# Altium schematic sheet 2_MCU.SchDoc
size A3; DocumentNumber: 3; SheetNumber: 3; SheetTotal: 6; PageSetup: Record=PageOptions|CenterHorizontal=True|CenterVertical=True|PrintScale=1.01|XCorrection=1.00|YCorrection=1.00|PrintKind=0|BorderSize=5000000|LeftOffset=0|BottomOffset=0|Orientation=2|PaperLength=1000|PaperWidth=1000|Scale=100|PaperSource=7|PrintQuality=-4|MediaType=1|DitherType=10|PaperKind=A3|PrintScaleMode=1
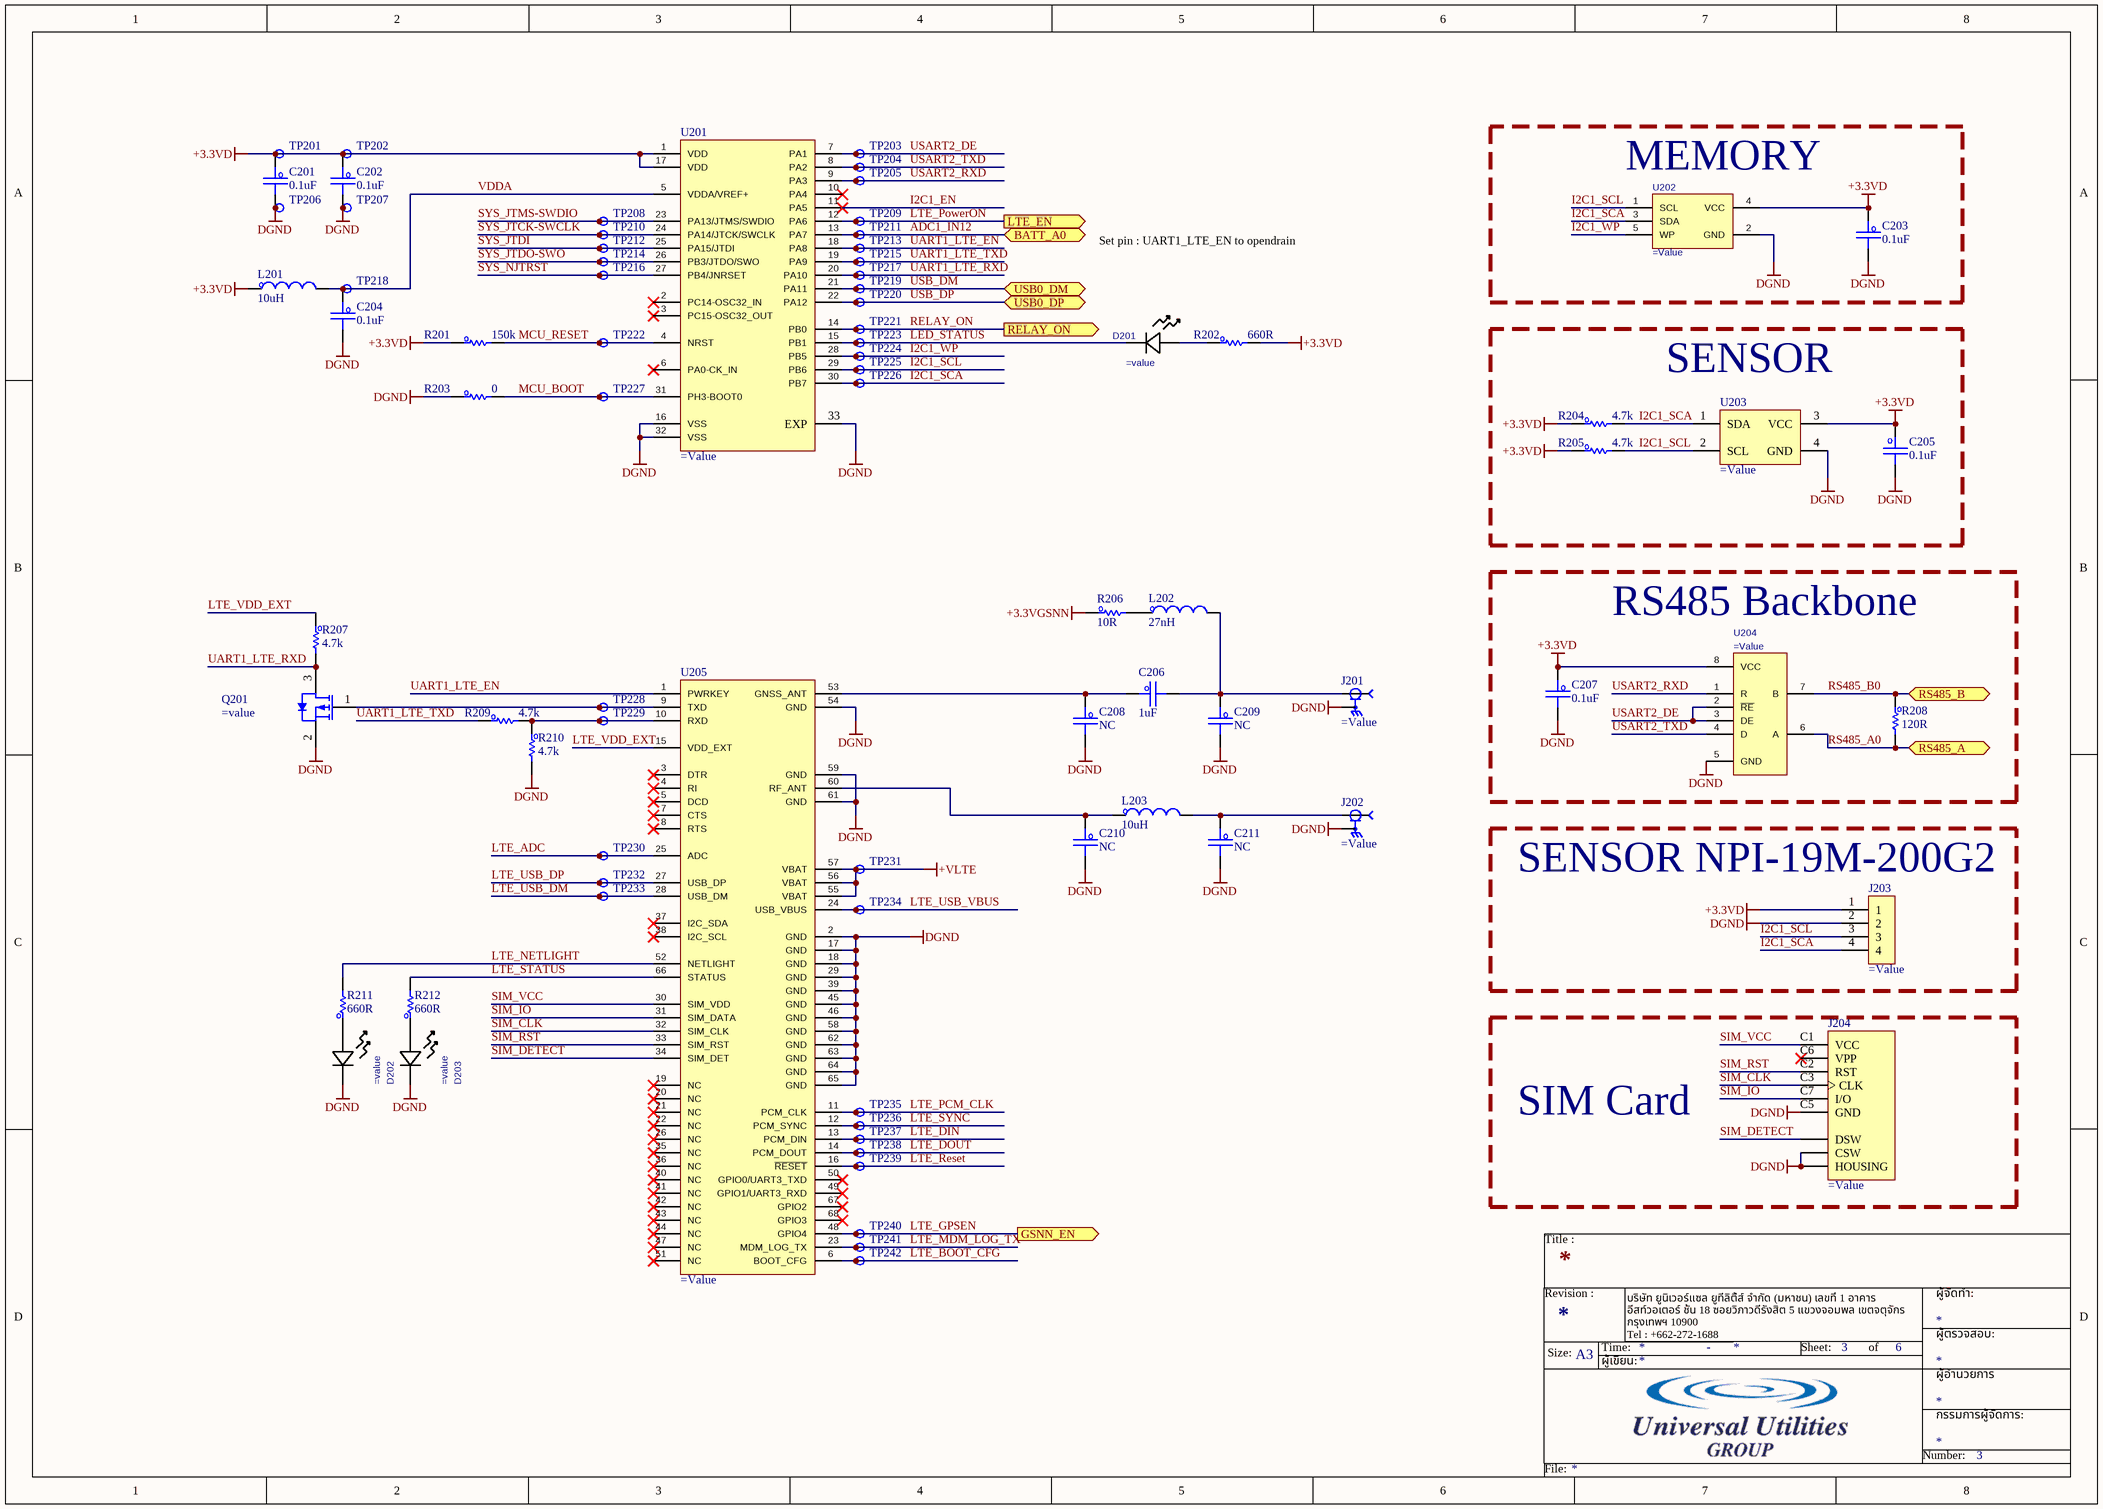
[diagram p0: 2_MCU.SchDoc]

## Parts
C201  0.1uF  [C_0603]
C202  0.1uF  [C_0603]
C203  0.1uF  [C_0603]
C204  0.1uF  [C_0603]
C205  0.1uF  [C_0603]
C206  1uF  [C_0603]
C207  0.1uF  [C_0603]
C208  NC  [C_0603]  (no BOM)
C209  NC  [C_0603]  (no BOM)
C210  NC  [C_0603]  (no BOM)
C211  NC  [C_0603]  (no BOM)
D201  (no value)  [LED_0VS75000_WRE]
D202  (no value)  [LED_0VS75000_WRE]
D203  (no value)  [LED_0VS75000_WRE]
J201  (no value)  [MOLEX_0734120114]
J202  (no value)  [MOLEX_0734120114]
J203  (no value)  [CON_4P_PADSENSOR]  (no BOM)
J204  (no value)  [JAE_SF72S006VBDR2500]
L201  10uH  [L_0603]
L202  27nH  [L_0603]
L203  10uH  [L_0603]
Q201  (no value)  [SOT95P245X110-3M]
R201  150k  [R_0603]
R202  660R  [R_0603]
R203  0  [R_0603]
R204  4.7k  [R_0603]
R205  4.7k  [R_0603]
R206  10R  [R_0603]
R207  4.7k  [R_0603]
R208  120R  [R_0603]
R209  4.7k  [R_0603]
R210  4.7k  [R_0603]
R211  660R  [R_0603]
R212  660R  [R_0603]
TP201  (no value)  [TP_Testpoint]  (no BOM)
TP202  (no value)  [TP_Testpoint]  (no BOM)
TP203  (no value)  [TP_Testpoint]  (no BOM)
TP204  (no value)  [TP_Testpoint]  (no BOM)
TP205  (no value)  [TP_Testpoint]  (no BOM)
TP206  (no value)  [TP_Testpoint]  (no BOM)
TP207  (no value)  [TP_Testpoint]  (no BOM)
TP208  (no value)  [TP_Testpoint]  (no BOM)
TP209  (no value)  [TP_Testpoint]  (no BOM)
TP210  (no value)  [TP_Testpoint]  (no BOM)
TP211  (no value)  [TP_Testpoint]  (no BOM)
TP212  (no value)  [TP_Testpoint]  (no BOM)
TP213  (no value)  [TP_Testpoint]  (no BOM)
TP214  (no value)  [TP_Testpoint]  (no BOM)
TP215  (no value)  [TP_Testpoint]  (no BOM)
TP216  (no value)  [TP_Testpoint]  (no BOM)
TP217  (no value)  [TP_Testpoint]  (no BOM)
TP218  (no value)  [TP_Testpoint]  (no BOM)
TP219  (no value)  [TP_Testpoint]  (no BOM)
TP220  (no value)  [TP_Testpoint]  (no BOM)
TP221  (no value)  [TP_Testpoint]  (no BOM)
TP222  (no value)  [TP_Testpoint]  (no BOM)
TP223  (no value)  [TP_Testpoint]  (no BOM)
TP224  (no value)  [TP_Testpoint]  (no BOM)
TP225  (no value)  [TP_Testpoint]  (no BOM)
TP226  (no value)  [TP_Testpoint]  (no BOM)
TP227  (no value)  [TP_Testpoint]  (no BOM)
TP228  (no value)  [TP_Testpoint]  (no BOM)
TP229  (no value)  [TP_Testpoint]  (no BOM)
TP230  (no value)  [TP_Testpoint]  (no BOM)
TP231  (no value)  [TP_Testpoint]  (no BOM)
TP232  (no value)  [TP_Testpoint]  (no BOM)
TP233  (no value)  [TP_Testpoint]  (no BOM)
TP234  (no value)  [TP_Testpoint]  (no BOM)
TP235  (no value)  [TP_Testpoint]  (no BOM)
TP236  (no value)  [TP_Testpoint]  (no BOM)
TP237  (no value)  [TP_Testpoint]  (no BOM)
TP238  (no value)  [TP_Testpoint]  (no BOM)
TP239  (no value)  [TP_Testpoint]  (no BOM)
TP240  (no value)  [TP_Testpoint]  (no BOM)
TP241  (no value)  [TP_Testpoint]  (no BOM)
TP242  (no value)  [TP_Testpoint]  (no BOM)
U201  (no value)  [QFN50P500X500X60-33N]
U202  (no value)  [SOT95P280X100-5N]
U203  (no value)  [XDCR_SHT40-AD1B-R2]
U204  (no value)  [D0008A_L]
U205  (no value)  [SIM7000A S2-1000]

## Blocks framed on the sheet
MEMORY: C203 U202
SENSOR: C205 R204 R205 U203
RS485 Backbone: C207 R208 U204
SENSOR NPI-19M-200G2: J203
SIM Card: J204

## Ports
BATT_A0 (bidir), GSNN_EN (out), LTE_EN (out), RELAY_ON (out), RS485_A (bidir), RS485_B (bidir), USB0_DM (bidir), USB0_DP (bidir)

## Nets
+3.3VD: C201.1 C202.1 C203.1 C205.1 C207.1 J203.1 L201.1 R201.1 R202.2 R204.1 R205.1 TP201.1 TP202.1 U201.1(VDD) U201.17(VDD) U202.4(VCC) U203.3(VCC) U204.8(VCC)
+3.3VGSNN: R206.1
+VLTE: TP231.1 U205.55(VBAT) U205.56(VBAT) U205.57(VBAT)
DGND: C201.2 C202.2 C203.2 C204.2 C205.2 C207.2 C208.2 C209.2 C210.2 C211.2 D202.2 D203.2 J201.2 J202.2 J203.2 J204.C5(GND) J204.CSW J204.SH(HOUSING) Q201.2(S) R203.1 R210.2 TP206.1 TP207.1 U201.16(VSS) U201.32(VSS) U201.33(EXP) U202.2(GND) U203.4(GND) U204.5(GND) U205.2(GND) U205.17(GND) U205.18(GND) U205.29(GND) U205.39(GND) U205.45(GND) U205.46(GND) U205.54(GND) U205.58(GND) U205.59(GND) U205.61(GND) U205.62(GND) U205.63(GND) U205.64(GND) U205.65(GND)
ADC1_IN12: TP211.1 U201.13(PA7) ; port BATT_A0
I2C1_EN: U201.11(PA5)
I2C1_SCA: J203.4 R204.2 TP226.1 U201.30(PB7) U202.3(SDA) U203.1(SDA)
I2C1_SCL: J203.3 R205.2 TP225.1 U201.29(PB6) U202.1(SCL) U203.2(SCL)
I2C1_WP: TP224.1 U201.28(PB5) U202.5(WP)
LED_STATUS: D201.2 TP223.1 U201.15(PB1)
LTE_ADC: TP230.1 U205.25(ADC)
LTE_BOOT_CFG: TP242.1 U205.6(BOOT_CFG)
LTE_DIN: TP237.1 U205.13(PCM_DIN)
LTE_DOUT: TP238.1 U205.14(PCM_DOUT)
LTE_GPSEN: TP240.1 U205.48(GPIO4) ; port GSNN_EN
LTE_MDM_LOG_TX: TP241.1 U205.23(MDM_LOG_TX)
LTE_NETLIGHT: R211.2 U205.52(NETLIGHT)
LTE_PCM_CLK: TP235.1 U205.11(PCM_CLK)
LTE_PowerON: TP209.1 U201.12(PA6) ; port LTE_EN
LTE_Reset: TP239.1 U205.16(~{RESET})
LTE_STATUS: R212.2 U205.66(STATUS)
LTE_SYNC: TP236.1 U205.12(PCM_SYNC)
LTE_USB_DM: TP233.1 U205.28(USB_DM)
LTE_USB_DP: TP232.1 U205.27(USB_DP)
LTE_USB_VBUS: TP234.1 U205.24(USB_VBUS)
LTE_VDD_EXT: R207.1 U205.15(VDD_EXT)
MCU_BOOT: R203.2 TP227.1 U201.31(PH3-BOOT0)
MCU_RESET: R201.2 TP222.1 U201.4(NRST)
RELAY_ON: TP221.1 U201.14(PB0) ; port RELAY_ON
RS485_A0: R208.2 U204.6(A) ; port RS485_A
RS485_B0: R208.1 U204.7(B) ; port RS485_B
SIM_CLK: J204.C3(CLK) U205.32(SIM_CLK)
SIM_DETECT: J204.DSW U205.34(SIM_DET)
SIM_IO: J204.C7(I/O) U205.31(SIM_DATA)
SIM_RST: J204.C2(RST) U205.33(SIM_RST)
SIM_VCC: J204.C1(VCC) U205.30(SIM_VDD)
SYS_JTCK-SWCLK: TP210.1 U201.24(PA14/JTCK/SWCLK)
SYS_JTDI: TP212.1 U201.25(PA15/JTDI)
SYS_JTDO-SWO: TP214.1 U201.26(PB3/JTDO/SWO)
SYS_JTMS-SWDIO: TP208.1 U201.23(PA13/JTMS/SWDIO)
SYS_NJTRST: TP216.1 U201.27(PB4/JNRSET)
UART1_LTE_EN: TP213.1 U201.18(PA8) U205.1(PWRKEY)
UART1_LTE_RXD: Q201.3(D) R207.2 TP217.1 U201.20(PA10)
UART1_LTE_TXD: R209.1 TP215.1 U201.19(PA9)
USART2_DE: TP203.1 U201.7(PA1) U204.2(~{RE}) U204.3(DE)
USART2_RXD: TP205.1 U201.9(PA3) U204.1(R)
USART2_TXD: TP204.1 U201.8(PA2) U204.4(D)
USB_DM: TP219.1 U201.21(PA11) ; port USB0_DM
USB_DP: TP220.1 U201.22(PA12) ; port USB0_DP
VDDA: C204.1 L201.2 TP218.1 U201.5(VDDA/VREF+)
NetC206_1: C206.1 C208.1 U205.53(GNSS_ANT)
NetC206_2: C206.2 C209.1 J201.1 L202.2
NetC210_1: C210.1 L203.1 U205.60(RF_ANT)
NetC211_1: C211.1 J202.1 L203.2
NetD201_1: D201.1 R202.1
NetD202_1: D202.1 R211.1
NetD203_1: D203.1 R212.1
NetL202_1: L202.1 R206.2
NetQ201_1: Q201.1(G) TP228.1 U205.9(TXD)
NetR209_2: R209.2 R210.1 TP229.1 U205.10(RXD)

Not connected (* = marked no-connect by the designer): J204 C6(VPP)*; U201 2(PC14-OSC32_IN)* 3(PC15-OSC32_OUT)* 6(PA0-CK_IN)* 10(PA4)*; U205 3(DTR)* 4(RI)* 5(DCD)* 7(CTS)* 8(RTS)* 19(NC)* 20(NC)* 21(NC)* 22(NC)* 26(NC)* 35(NC)* 36(NC)* 37(I2C_SDA)* 38(I2C_SCL)* 40(NC)* 41(NC)* 42(NC)* 43(NC)* 44(NC)* 47(NC)* 49(GPIO1/UART3_RXD)* 50(GPIO0/UART3_TXD)* 51(NC)* 67(GPIO2)* 68(GPIO3)*

## Notes on the sheet
- Set pin : UART1_LTE_EN to opendrain
- Title :
- Revision :
- ผู้จัดทำ:
- Size:
- A3
- Time:
- ผู้เขียน:
- บริษัท ยูนิเวอร์แซล ยูทีลิตี้ส์ จำกัด (มหาชน) เลขที่ 1 อาคาร อีสท์วอเตอร์ ชั้น 18 ซอยวิภาวดีรังสิต 5 แขวงจอมพล เขตจตุจักร กรุงเทพฯ 10900
  Tel : +662-272-1688
  Fax :+662-2721690-1
- -
- Sheet:
- of
- ผู้อำนวยการ
- ผู้ตรวจสอบ:
- Number:
- กรรมการผู้จัดการ:
- File:

## Library data of the parts
C201-C205 C207 = C_Capacitor: CAP CER 0.1UF 50V X7R 0603; Manufacturer: KEMET; PartNumber: C0603C104K5RACTU; PackageReference: 0603; PartID: 399-5089-1-ND; Value2: 50V; Value: 0.1uF; Value3: *
C206 C208-C211 = C_Capacitor: Capacitor; Manufacturer: *; PackageReference: 0402; PartID: *; PartNumber: *; Value2: *; Value3: *
  C206: Value: 1uF
  C208-C211: Value: NC
D201-D203 = D_LED_150060BS75000: LED BLUE CLEAR 0603 SMD; Manufacturer: Wurth Electronics; Value: 150060VS75000; PackageReference: 0603; PartID: 732-4980-1-ND; PartNumber: 150060VS75000
J201 J202 = CON_U.FL: CONN UMC RCPT STR 50 OHM SMD; PartNumber: 0734120114; Manufacturer: Molex; Value: 0734120114; PartID: WM3894CT-ND; PackageReference: U.FL; Value3: *
J203 = CON_4P_Heder: Connector 4 position; PartNumber: *; PartID: *; Manufacturer: *; PackageReference: *; Value: *; Value2: *; Value3: *
J204 = CON_SIM_NanoSP: NANO SIM CARD CONNECTOR; PartNumber: SF72S006VBDR2500; Manufacturer: JAE Electronics; Value: SF72S006VBDR2500; PartID: 670-2967-1-ND; PackageReference: *; Value2: *; Value3: *
L201-L203 = L_Inductor: 10µH Shielded Multilayer Inductor 250mA 1.05Ohm 0603 (1608 Metric); Manufacturer: TDK Corporation; PartNumber: MLZ1608M100WT000; PackageReference: 0603; PartID: 445-6389-1-ND; Value3: *
  L201 L203: Value: 10uH
  L202: Value: 27nH
Q201 = Q_PMOS_DMP2004K-7: MOSFET P-CH 20V 600MA SOT23-3; Manufacturer: Diodes Incorporated; Value: DMP2004K-7; PackageReference: SOT23-5; PartID: DMP2004KDICT-ND; PartNumber: DMP2004K-7; Value3: *
R201 = R_Resister: RES SMD 150K OHM 1% 1/10W 0603; Manufacturer: Vishay Dale; PartNumber: CRCW0603150KFKEAC; Value2: 0.1W; Value: 150k; PackageReference: 0603; PartID: 541-4034-1-ND; Value3: *
R202 R211 R212 = R_Resister: RES SMD 220 OHM 1% 1/10W 0603; Value: 660R; PackageReference: 0603; Value3: *
R203 = R_Resister: RES SMD 0 OHM JUMP 1/10W 0603; Manufacturer: Vishay Dale; PartNumber: CRCW06030000Z0EBC; Value2: 0.1W; Value: 0; PackageReference: 0603; PartID: 541-4013-1-ND; Value3: *
R204 R205 R207 R209 R210 = R_Resister: RES 4.7K OHM 5% 1/10W 0603; Manufacturer: Vishay Dale; PartNumber: CRCW06034K70JNEBC; Value2: 0.1W; Value: 4.7k; PackageReference: 0603; PartID: 541-CRCW06034K70JNEBCCT-ND; Value3: *
R206 = R_Resister: Resistor; Manufacturer: Vishay; PartNumber: EXB-2HV472JV; Value: 10R; PackageReference: 0603; PartID: *; Value2: *; Value3: *
R208 = R_Resister: RES SMD 120 OHM 1% 1/3W 0603; Manufacturer: Vishay Dale; PartNumber: CRCW0603120RFKEAHP; Value2: 0.333W; Value: 120R; PackageReference: 0603; PartID: 541-120SCT-ND; Value3: *
TP201-TP242 = TP_TestPoint: TestPoint; Manufacturer: *; PackageReference: *; PartID: *; PartNumber: *; Value2: *; Value3: *
U201 = IC_MCU_STM32L432: IC MCU 32BIT 256KB FLSH 32UFQFPN; PartNumber: STM32L432KCU6; Manufacturer: STMicroelectronics; Value: STM32L432KCU6; PartID: 497-16578-ND; PackageReference: *; Value2: *; Value3: *
U202 = IC_MEM_AT24C04D-STUM-T: IC EEPROM 4KBIT I2C 1MHZ SOT23-5; Manufacturer: Microchip Technology; Value: AT24C04D-STUM-T; PackageReference: SOT23-5; PartID: AT24C04D-STUM-TCT-ND; PartNumber: AT24C04D-STUM-T
U203 = IC_SEN_SHT40-AD1B-R3: SENSOR HUMIDITY 100 RH SMD; Manufacturer: Sensirion AG; PartNumber: SHT40-AD1B-R3; PartID: 1649-SHT40-AD1B-R3CT-ND; PackageReference: QFN-4; Value: SHT40-AD1B-R3; Value2: *; Value3: *
U204 = IC_TRAN_THVD1505DR: IC TRANSCEIVER HALF 1/1 8SOIC; Manufacturer: Texas Instruments; PartNumber: SN65HVD11DR; Value: SN65HVD11DR; PackageReference: 8SOIC; PartID: 0086-0766-1; Value3: SN65HVD11DR
U205 = IC_MOD_SIM7000X: DGTL ISO 5000VRMS 6CH 16SOIC; Manufacturer: SIMCom Wireless Solutions Limited; Value: SIM7000G; Value3: 680 bth; PackageReference: QFN-68; PartNumber: SIM7000G